# EasyEDA schematic SCH_ECU_Standalone_V2.1.json
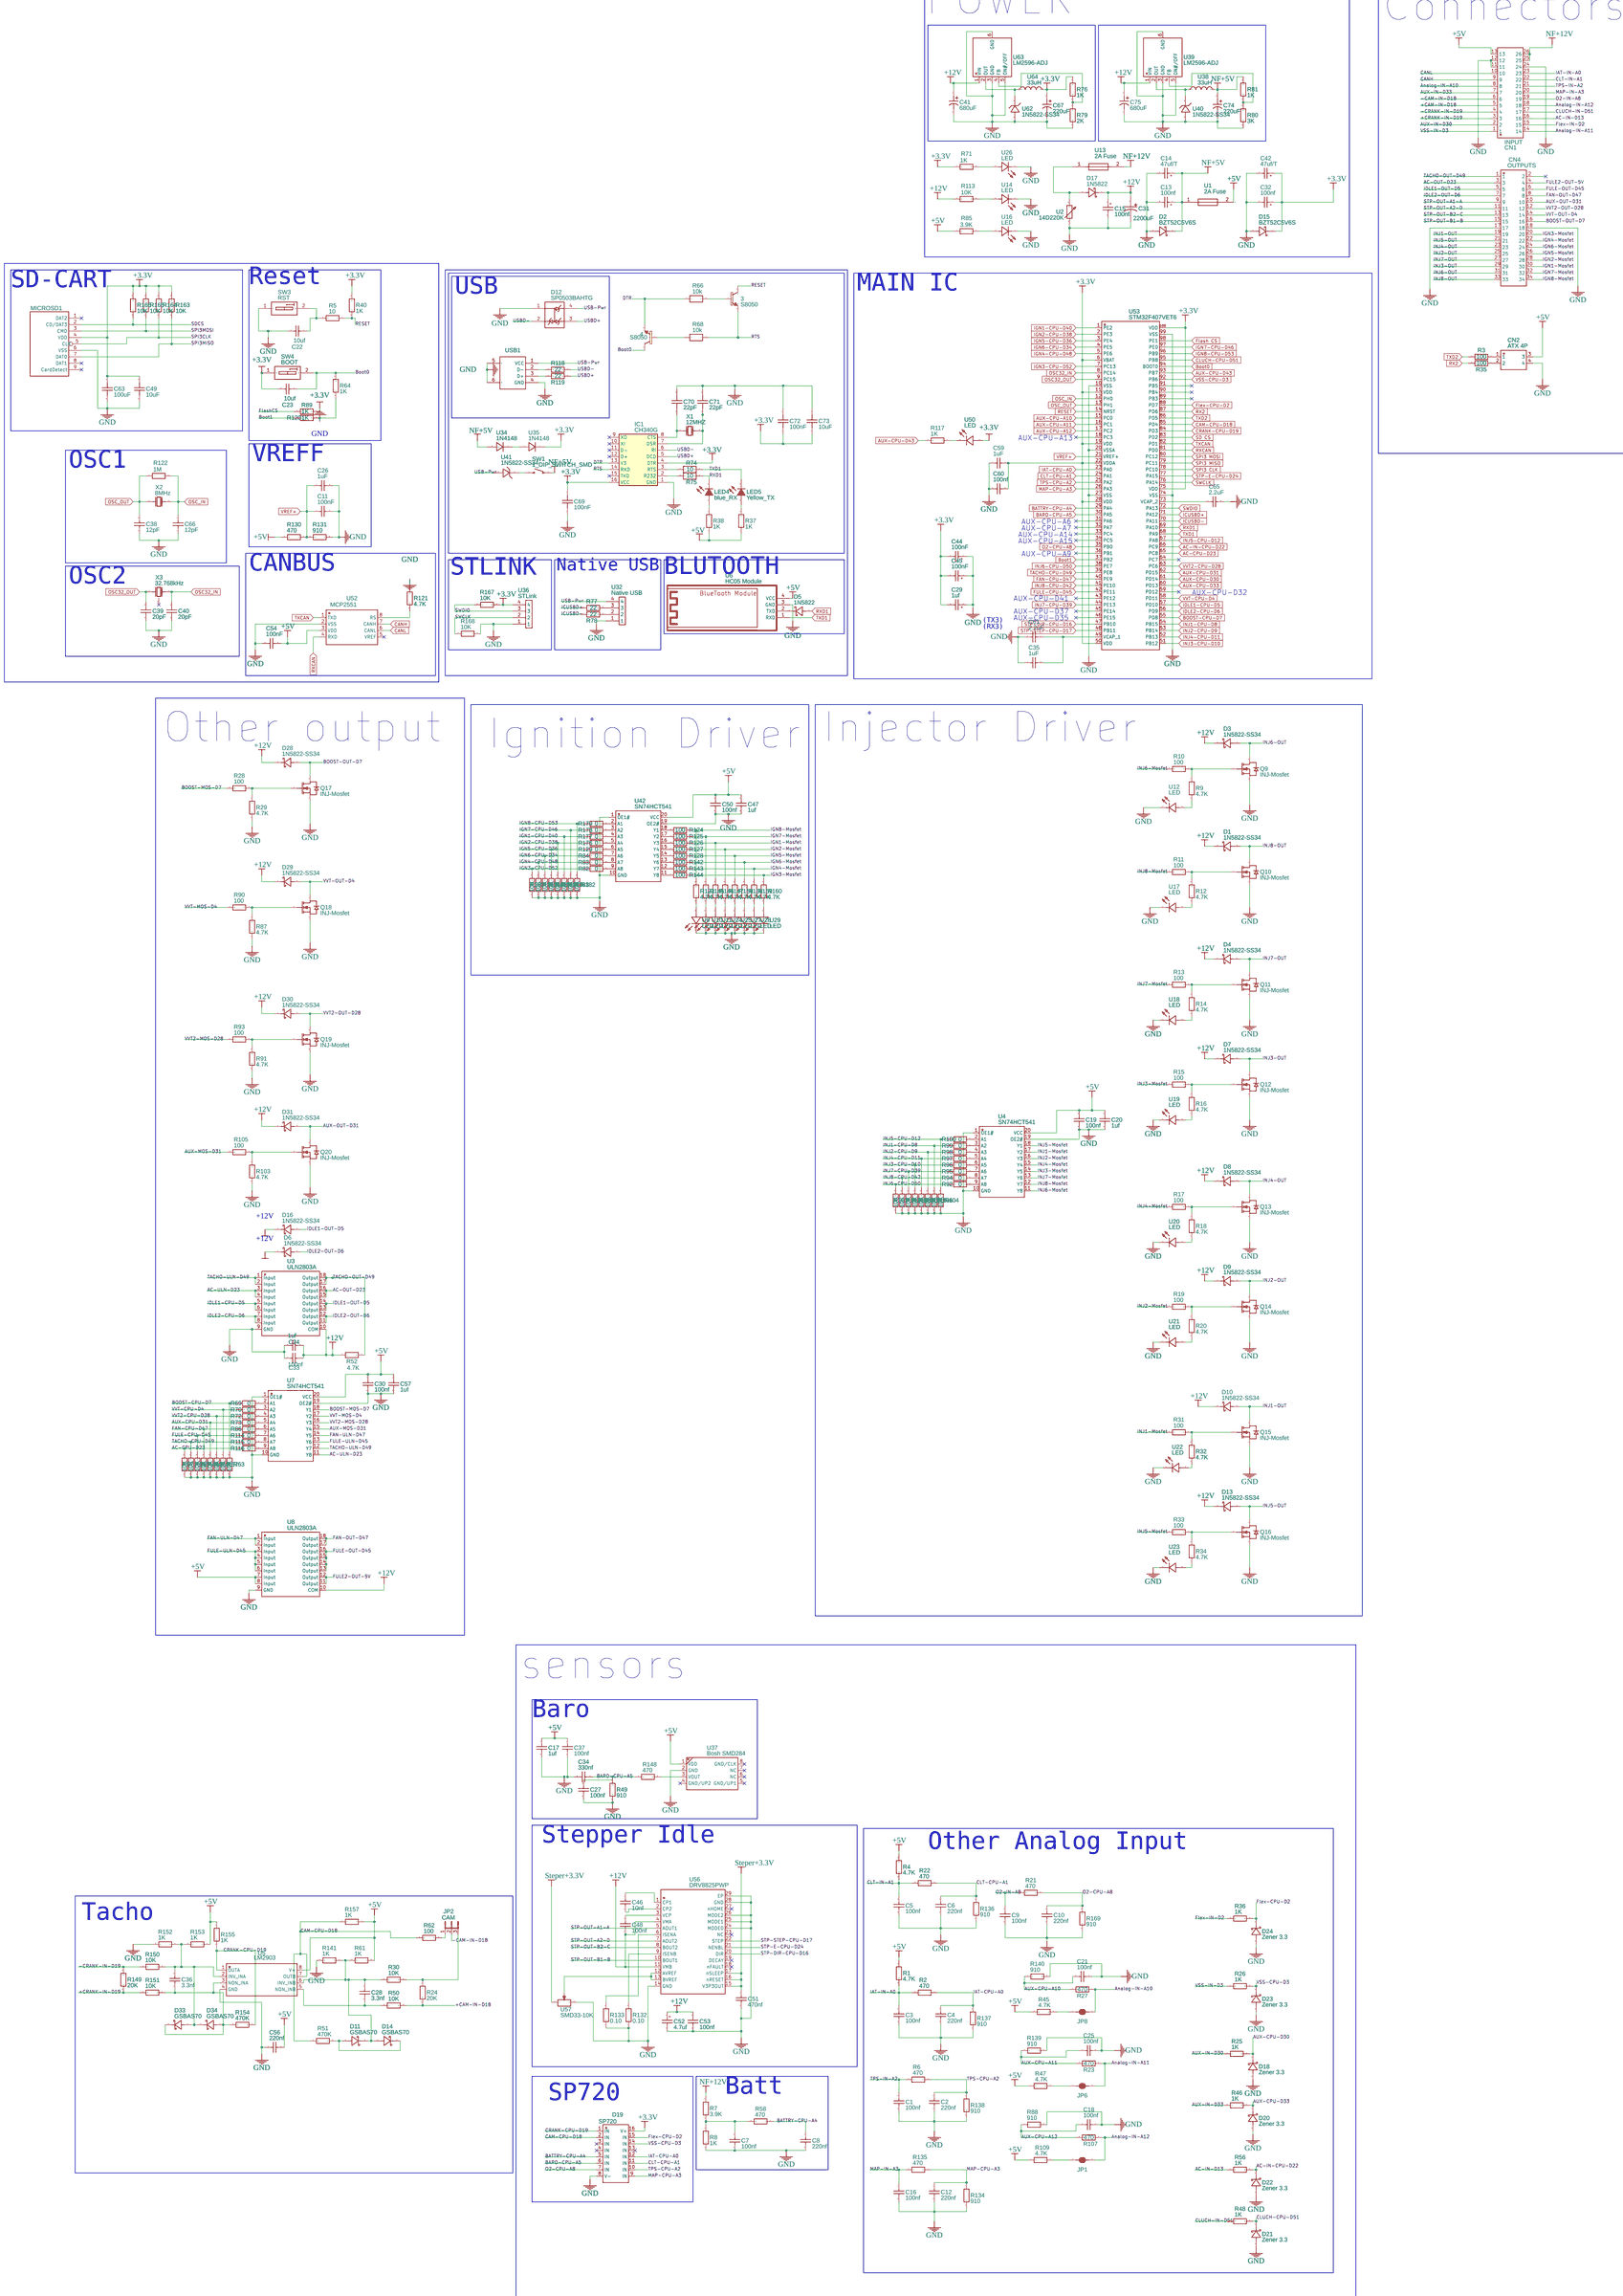
[diagram p0: schematic sheet]

## Parts
3  S8050  [SOT-23-3]
4  S8050  [SOT-23-3]
C1  100nf  [C0805]
C2  220nf  [C0805]
C3  100nf  [C0805]
C4  220nf  [C0805]
C5  100nf  [C0805]
C6  220nf  [C0805]
C7  100nf  [C0805]
C8  220nf  [C0805]
C9  100nf  [C0805]
C10  220nf  [C0805]
C11  100nF  [C0805]
C12  220nf  [C0805]
C13  100nf  [C 2512 - 0805]
C14  47uf/T  [C 2512 - 0805]
C15  100nf  [C 2512 - 0805]
C16  100nf  [C0805]
C17  1uf  [C0805]
C18  100nf  [C0805]
C19  100nf  [C0805]
C20  1uf  [C0805]
C21  100nf  [C0805]
C22  10uf  [C0805]
C23  10uf  [C0805]
C24  1uf  [C0805]
C25  100nf  [C0805]
C26  1uF  [C0805]
C27  100nf  [C0805]
C28  3.3nf  [C0805]
C29  1uf  [C 2512 - 0805]
C30  100nf  [C0805]
C31  2200uF  [CAP-TH_BD12.5-P5.00-D0.6-FD]
C32  100nf  [C 2512 - 0805]
C33  100nf  [C0805]
C34  330nf  [C0805]
C35  1uF  [C0805]
C36  3.3nf  [C0805]
C37  100nf  [C0805]
C38  12pF  [C0805]
C39  20pF  [C0805]
C40  20pF  [C0805]
C41  680uF  [CAP SMD 6.3 &#126; 8 DIP 25V]
C42  47uf/T  [C 2512 - 0805]
C44  100nF  [C 2512 - 0805]
C45  100nF  [C 2512 - 0805]
C46  10nf  [C0805]
C47  1uf  [C0805]
C48  100nf  [C0805]
C49  10uF  [C0805]
C50  100nf  [C0805]
C51  470nf  [C0805]
C52  4.7uf  [C 2512 - 0805]
C53  100nf  [C0805]
C54  100nF  [C0805]
C56  220nf  [C0805]
C57  1uf  [C0805]
C59  1uF  [C0805]
C60  100nf  [C0805]
C61  2.2uF  [C0805]
C63  100uF  [C0805]
C65  2.2uF  [C0805]
C66  12pF  [C0805]
C67  220uF  [CAP SMD 6.3 &#126; 8 DIP 25V]
C69  100nF  [C0805]
C70  22pF  [C0805]
C71  22pF  [C0805]
C72  100nF  [C0805]
C73  10uF  [C0805]
C74  220uF  [CAP SMD 6.3 &#126; 8 DIP 25V]
C75  680uF  [CAP SMD 6.3 &#126; 8 DIP 25V]
CN1  INPUT  [CONN-TH_26P-P2.50_MX23A26NF1]
CN2  ATX 4P  [CONN-TH_C4201WR-2X2P]
CN4  OUTPUTS  [CONN-TH_34P-P2.50_MX23A34NF6]
D1  1N5822-SS34  [DIOD SOD-123]
D2  BZT52C5V6S  [DIOD SOD-123]
D3  1N5822-SS34  [DIOD SOD-123]
D4  1N5822-SS34  [DIOD SOD-123]
D5  1N5822  [DIOD SOD-123]
D6  1N5822-SS34  [DIOD SOD-123]
D7  1N5822-SS34  [DIOD SOD-123]
D8  1N5822-SS34  [DIOD SOD-123]
D9  1N5822-SS34  [DIOD SOD-123]
D10  1N5822-SS34  [DIOD SOD-123]
D11  GSBAS70  [SOD-323_L1.7-W1.3-LS2.5-FD-1]
D12  SP0503BAHTG  [SOT-143_L2.9-W1.3-P1.92-LS2.3-BR]
D13  1N5822-SS34  [DIOD SOD-123]
D14  GSBAS70  [SOD-323_L1.7-W1.3-LS2.5-FD-1]
D15  BZT52C5V6S  [DIOD SOD-123]
D16  1N5822-SS34  [DIOD SOD-123]
D17  1N5822  [DIOD SOD-123]
D18  Zener 3.3  [DIOD SOD-123]
D19  SP720  [SOIC-16_L9.9-W3.9-P1.27-LS6.0-BL]
D20  Zener 3.3  [DIOD SOD-123]
D21  Zener 3.3  [DIOD SOD-123]
D22  Zener 3.3  [DIOD SOD-123]
D23  Zener 3.3  [DIOD SOD-123]
D24  Zener 3.3  [DIOD SOD-123]
D28  1N5822-SS34  [DIOD SOD-123]
D29  1N5822-SS34  [DIOD SOD-123]
D30  1N5822-SS34  [DIOD SOD-123]
D31  1N5822-SS34  [DIOD SOD-123]
D33  GSBAS70  [SOD-323_L1.7-W1.3-LS2.5-FD-1]
D34  GSBAS70  [SOD-323_L1.7-W1.3-LS2.5-FD-1]
IC1  CH340G  [SOIC-16_150MIL]
JP1  Pull-Up  [SJ_2S-NO]
JP2  CAM  [JUMPER 3X1 (PIN= 2.54) SMD]
JP6  Pull-Up  [SJ_2S-NO]
JP8  Pull-Up  [SJ_2S-NO]
LED4  blue_RX  [LED0805-R-RD]
LED5  Yellow_TX  [LED0805-R-RD]
MICROSD1  MicroSD_Slot  [MICROSD SLOT]
Q9  INJ-Mosfet  [TO-252-2_L6.6-W6.1-P4.58-LS9.9-TL]
Q10  INJ-Mosfet  [TO-252-2_L6.6-W6.1-P4.58-LS9.9-TL]
Q11  INJ-Mosfet  [TO-252-2_L6.6-W6.1-P4.58-LS9.9-TL]
Q12  INJ-Mosfet  [TO-252-2_L6.6-W6.1-P4.58-LS9.9-TL]
Q13  INJ-Mosfet  [TO-252-2_L6.6-W6.1-P4.58-LS9.9-TL]
Q14  INJ-Mosfet  [TO-252-2_L6.6-W6.1-P4.58-LS9.9-TL]
Q15  INJ-Mosfet  [TO-252-2_L6.6-W6.1-P4.58-LS9.9-TL]
Q16  INJ-Mosfet  [TO-252-2_L6.6-W6.1-P4.58-LS9.9-TL]
Q17  INJ-Mosfet  [TO-252-2_L6.6-W6.1-P4.58-LS9.9-TL]
Q18  INJ-Mosfet  [TO-252-2_L6.6-W6.1-P4.58-LS9.9-TL]
Q19  INJ-Mosfet  [TO-252-2_L6.6-W6.1-P4.58-LS9.9-TL]
Q20  INJ-Mosfet  [TO-252-2_L6.6-W6.1-P4.58-LS9.9-TL]
R1  4.7K  [R0805]
R2  470  [R0805]
R3  100  [R0805]
R4  4.7K  [R0805]
R5  10  [R0805]
R6  470  [R0805]
R7  3.9K  [R0805]
R8  1K  [R0805]
R9  4.7K  [R0805]
R10  100  [R0805]
R11  100  [R0805]
R12  4.7K  [R0805]
R13  100  [R0805]
R14  4.7K  [R0805]
R15  100  [R0805]
R16  4.7K  [R0805]
R17  100  [R0805]
R18  4.7K  [R0805]
R19  100  [R0805]
R20  4.7K  [R0805]
R21  470  [R0805]
R22  470  [R0805]
R23  470  [R0805]
R24  20K  [R0805]
R25  1K  [R0805]
R26  1K  [R0805]
R27  470  [R0805]
R28  100  [R0805]
R29  4.7K  [R0805]
R30  10K  [R0805]
R31  100  [R0805]
R32  4.7K  [R0805]
R33  100  [R0805]
R34  4.7K  [R0805]
R35  100  [R0805]
R36  1K  [R0805]
R37  1K  [R0805]
R38  1K  [R0805]
R40  1K  [R0805]
R41  10K  [R0805]
R42  10K  [R0805]
R43  10K  [R0805]
R45  4.7K  [R0805]
R46  1K  [R0805]
R47  4.7K  [R0805]
R48  1K  [R0805]
R49  910  [R0805]
R50  10K  [R0805]
R51  470K  [R0805]
R52  4.7K  [R0805]
R54  10K  [R0805]
R56  1K  [R0805]
R57  10K  [R0805]
R58  470  [R0805]
R61  1K  [R0805]
R62  100  [R0805]
R63  10K  [R0805]
R64  1K  [R0805]
R65  10K  [R0805]
R66  10k  [0805]
R67  10K  [R0805]
R68  10k  [0805]
R69  0  [R0805]
R70  0  [R0805]
R71  1K  [R0805]
R72  0  [R0805]
R73  0  [R0805]
R74  10  [0805]
R75  10  [0805]
R76  1K  [R0805]
R77  22  [R0805]
R78  22  [R0805]
R79  2K  [R0805]
R80  3K  [R0805]
R81  1K  [R0805]
R82  0  [R0805]
R83  0  [R0805]
R84  0  [R0805]
R85  3.9K  [R0805]
R86  0  [R0805]
R87  4.7K  [R0805]
R88  910  [R0805]
R89  1K  [R0805]
R90  100  [R0805]
R91  4.7K  [R0805]
R92  0  [R0805]
R93  100  [R0805]
R94  0  [R0805]
R95  0  [R0805]
R96  0  [R0805]
R97  0  [R0805]
R98  0  [R0805]
R99  0  [R0805]
R100  0  [R0805]
R101  10K  [R0805]
R102  10K  [R0805]
R103  4.7K  [R0805]
R104  10K  [R0805]
R105  100  [R0805]
R106  10K  [R0805]
R107  470  [R0805]
R108  10K  [R0805]
R109  4.7K  [R0805]
R110  10K  [R0805]
R111  10K  [R0805]
R112  10K  [R0805]
R113  10K  [R0805]
R114  0  [R0805]
R115  0  [R0805]
R116  0  [R0805]
R117  1K  [R0805]
R118  22  [R0805]
R119  22  [R0805]
R120  1K  [R0805]
R121  4.7K  [R0805]
R122  1M  [R0805]
R123  4.7K  [R0805]
R124  100  [R0805]
R125  100  [R0805]
R126  100  [R0805]
R127  100  [R0805]
R128  100  [R0805]
R129  0  [R0805]
R130  470  [R0805]
R131  910  [R0805]
R132  0.10  [R0805]
R133  0.10  [R0805]
R134  910  [R0805]
R135  470  [R0805]
R136  910  [R0805]
R137  910  [R0805]
R138  910  [R0805]
R139  910  [R0805]
R140  910  [R0805]
R141  1K  [R0805]
R142  100  [R0805]
R143  100  [R0805]
R144  100  [R0805]
R145  4.7K  [R0805]
R146  4.7K  [R0805]
R147  4.7K  [R0805]
R148  470  [R0805]
R149  20K  [R0805]
R150  10K  [R0805]
R151  10K  [R0805]
R152  1K  [R0805]
R153  1K  [R0805]
R154  470K  [R0805]
R155  1K  [R0805]
R156  4.7K  [R0805]
R157  1K  [R0805]
R158  4.7K  [R0805]
R159  4.7K  [R0805]
R160  4.7K  [R0805]
R163  10K  [R0805]
R164  10K  [R0805]
R165  10K  [R0805]
R166  10K  [R0805]
R167  10K  [R0805]
R168  10K  [R0805]
R169  910  [R0805]
R176  0  [R0805]
R177  0  [R0805]
R178  0  [R0805]
R179  0  [R0805]
R180  10K  [R0805]
R181  10K  [R0805]
R182  10K  [R0805]
R183  10K  [R0805]
R184  10K  [R0805]
R185  10K  [R0805]
R186  10K  [R0805]
R187  10K  [R0805]
SW1  1_DIP_SWITCH_SMD  [1_DIP_SWITCH_SMD]
SW3  RST  [SW-SMD_L5.4-W2.8-LS8.2]
SW4  BOOT  [SW-SMD_L5.4-W2.8-LS8.2]
U1  2A Fuse  [CAR FUSE]
U2  14D220K  [PS-RES-16.5*7.51_SMALLER]
U3  ULN2803A  [SOP-18_L11.4-W7.6-P1.27-LS10.6-BL]
U4  SN74HCT541  [SOIC-20_L12.8-W7.5-P1.27-LS10.3-BL]
U5  LM2903  [SOIC-8_L4.9-W3.9-P1.27-LS6.0-BL]
U6  HC05 Module  [HC05_MODULE]
U7  SN74HCT541  [SOIC-20_L12.8-W7.5-P1.27-LS10.3-BL]
U8  ULN2803A  [SOP-18_L11.4-W7.6-P1.27-LS10.6-BL]
U9  LED  [LED0805-RD_RED]
U10  LED  [LED0805-RD_RED]
U11  LED  [LED0805-RD_RED]
U12  LED  [LED0805-RD_RED]
U13  2A Fuse  [CAR FUSE]
U14  LED  [LED0805-RD_RED]
U16  LED  [LED0805-RD_RED]
U17  LED  [LED0805-RD_RED]
U18  LED  [LED0805-RD_RED]
U19  LED  [LED0805-RD_RED]
U20  LED  [LED0805-RD_RED]
U21  LED  [LED0805-RD_RED]
U22  LED  [LED0805-RD_RED]
U23  LED  [LED0805-RD_RED]
U24  LED  [LED0805-RD_RED]
U25  LED  [LED0805-RD_RED]
U26  LED  [LED0805-RD_RED]
U27  LED  [LED0805-RD_RED]
U28  LED  [LED0805-RD_RED]
U29  LED  [LED0805-RD_RED]
U32  Native USB  [1X4 HEADER (PIN = 2.54)]
U34  1N4148  [LL-34_L3.5-W1.5-RD]
U35  1N4148  [LL-34_L3.5-W1.5-RD]
U36  STLink  [1X4 HEADER (PIN = 2.54)]
U37  Bosh SMD284  [BOSH SMD284]
U38  33uH  [IND-SMD_L12.3-W12.3]
U39  LM2596-ADJ  [TO-263-5_L10.2-W8.6-P1.70-LS14.4-TL]
U40  1N5822-SS34  [SMB_L4.3-W3.6-LS5.4-RD]
U41  1N5822-SS34  [SMB_L4.3-W3.6-LS5.4-RD]
U42  SN74HCT541  [SOIC-20_L12.8-W7.5-P1.27-LS10.3-BL]
U50  LED  [LED0805-RD_RED]
U52  MCP2551  [SOIC-8_L5.0-W4.0-P1.27-LS6.0-BL]
U53  STM32F407VET6  [LQFP-100_L14.0-W14.0-P0.50-LS16.0-BL]
U56  DRV8825PWP  [HTSSOP-28_L9.7-W4.4-P0.65-LS6.4-BL-EP]
U57  SMD33-10K  [RES-ADJ-SMD_SMD33-10K]
U62  1N5822-SS34  [SMB_L4.3-W3.6-LS5.4-RD]
U63  LM2596-ADJ  [TO-263-5_L10.2-W8.6-P1.70-LS14.4-TL]
U64  33uH  [IND-SMD_L12.3-W12.3]
USB1  U241-041N-1BR85-1  [USB-B-TH_U241-041N-1BR85-1]
X1  12MHZ  [HC-49S_L11.4-W4.8-LS12.7]
X2  8MHz  [HC-49S_L11.4-W4.8-LS12.7]
X3  32.768kHz  [OSC-SMD_BD2.0-P2.54_TMXLI-206F32.768KHZ12.5PF20PPM]

## Library data of the parts
3 4 = J3Y_S8050_SMD_NPN_TRANSISTOR: Contributor: Tomaž Pačnik
C1-C12 C16-C28 C30 C33-C40 C46-C48 C50 C51 C53 C54 C56 C57 C59-C61 C65 C66 = C0805X103K251T: Supplier: LCSC; Manufacturer: IHHEC(禾伸堂); Supplier Part: C105949; JLCPCB Part Class: Extended Part
C13-C15 C32 C42 C44 C45 C52 = C SMD (2512 - 0805): Supplier: LCSC; Supplier Part: C269368; Manufacturer: Tyohm; Manufacturer Part: RMC25124.7K1%N; Resistance (Ohms): 1uf; Contributor: amir slz; JLCPCB Part Class: Extended Part
C29 = C SMD (2512 - 0805): Supplier: LCSC; Supplier Part: C269368; Manufacturer: Tyohm; Manufacturer Part: RMC25124.7K1%N; Contributor: amir slz; JLCPCB Part Class: Extended Part
C31 = 25YXG2200MEFCG412.5X35: Contributor: lcsc; Supplier: LCSC; Supplier Part: C5114672; Manufacturer: rubycon(红宝石)
C41 C67 C74 C75 = CAP 6.3 &#126; 0.8 DIP 25v: Supplier Part: C2693600; Manufacturer: SAMYOUNG(韩国三莹); Manufacturer Part: MVK16V100UF6.3*6; JLCPCB Part Class: Extended Part; Contributor: amir slz
C49 C63 C69-C73 = C0805C682KMRECAUTO7210: Supplier: LCSC; Supplier Part: C1625609; Manufacturer: KEMET(基美); Contributor: LCSC; JLCPCB Part Class: Extended Part
CN1 = MX23A26NF1: Supplier: LCSC; Supplier Part: C2977281; Manufacturer: JAE(日本航空电子); Contributor: lcsc; JLCPCB Part Class: Extended Part
CN2 = C4201WR-2X2P: Contributor: LCSC; Supplier: LCSC; Supplier Part: C239496; Manufacturer: CJT(长江连接器); Manufacturer Part: C4201WR-2x2P; JLCPCB Part Class: Extended Part
CN4 = MX23A34NF1: Supplier: LCSC; Supplier Part: C2977283; Manufacturer: JAE(日本航空电子); JLCPCB Part Class: Extended Part; Contributor: lcsc
D1-D10 D13 D15-D18 D20-D24 D28-D31 = DIOD SOD-123: Contributor: amir slz; Supplier: LCSC; Supplier Part: C2905649; Manufacturer: TECH PUBLIC(台舟); Manufacturer Part: 1N5819HW; JLCPCB Part Class: Extended Part
D11 D14 D33 D34 = GSBAS70WS: Supplier: LCSC; Supplier Part: C19840816; Manufacturer: GOOD-ARK(固锝); JLCPCB Part Class: Extended Part; Contributor: lcsc
D12 = SP0503BAHTG: Supplier: LCSC; Manufacturer: Littelfuse; image: //image.lceda.cn/szlcsc/C7074.jpg; Supplier Part: C7074; LCSC Assembly: Yes; SMT Type: Extend
D19 = SP720ABTG: Supplier: LCSC; Supplier Part: C434726; Manufacturer: Littelfuse; Contributor: LCSC; JLCPCB Part Class: Extended Part
IC1 = -: Supplier: LCSC; Manufacturer: WCH; LCSC Assembly: Yes; Supplier Part: C14267
JP1 JP6 JP8 = SOLDERJUMPER-OLDNO: Solder Jumper; Contributor: SparkFun
JP2 = JUMPER 3X1 (PIN= 2.54) SMD: Jumper 2 Pin; Contributor: amir slz; sourceId: neOM8uspn
LED4 LED5 = 0805-1-YGC/FID: Contributor: lcsc; Supplier: LCSC; Supplier Part: C9900013796; Manufacturer: null; JLCPCB Part Class: Extended Part; link: https://lcsc.com/eda_search?q=C9900013796&%26type=1&ref=editor
MICROSD1 = -: Manufacturer Part: MicroSD Slot; Contributor: FromRussia
Q9-Q20 = PHD45N03LTA: Contributor: LCSC; Supplier: LCSC; Supplier Part: C693162; Manufacturer: VBsemi(微碧半导体); Manufacturer Part: PHD45N03LTA-VB; JLCPCB Part Class: Extended Part
R1-R36 R40-R43 R45-R52 R54 R56-R58 R61-R65 R67 R69-R73 R76-R160 R167-R169 R176-R187 = AECR0805F: Supplier: LCSC; Supplier Part: C352165; Manufacturer: ResistorToday; Manufacturer Part: AECR0805F9K10K9; Resistance (Ohms): 9.1K; Contributor: myungsoo4545; JLCPCB Part Class: Extended Part
R37 R38 = RC0805FR-072K74L: Supplier: LCSC; Manufacturer: YAGEO; Supplier Part: C137554; JLCPCB Part Class: Extended Part
R66 R68 R74 R75 = Res_0805(1/8W)_EU
R163-R166 = 500M: Contributor: LCSC; Supplier: LCSC; Supplier Part: C9900011239; Manufacturer: null; JLCPCB Part Class: Extended Part
SW1 = 1_DIP_SWITCH_SMD: Contributor: amir slz
SW3 SW4 = BDSWITCH-2PIN-1CH-1R27-SMD-V: Supplier: LCSC; Supplier Part: C9900022896; Manufacturer: null; Manufacturer Part: BDSwitch-2pin-1CH-1r27-SMD-V; JLCPCB Part Class: Extended Part; Contributor: lcsc
U1 U13 = Car fuse mini: Supplier Part: Fuse; Contributor: wygralakmarek
U2 = 14D220K: Supplier: LCSC; Manufacturer: HEL; Supplier Part: C136782
U3 U8 = ULN2803A_C845537: Supplier: LCSC; Supplier Part: C845537; Manufacturer: UMW(Youtai Semiconductor Co., Ltd.); Contributor: LCSC; JLCPCB Part Class: Extended Part
U4 U7 U42 = SN74HCT541DWE4: Contributor: LCSC; Supplier: LCSC; Supplier Part: C1548616; Manufacturer: TI(德州仪器); JLCPCB Part Class: Extended Part
U5 = LM2903M/NOPB: Contributor: LCSC; Supplier: LCSC; Supplier Part: C2864309; Manufacturer: TI(德州仪器); JLCPCB Part Class: Extended Part
U6 = HC05 Module: Contributor: amirslz74
U9-U12 U14 U16-U29 U50 = 0805 SF-RED: Contributor: lcsc; Supplier: LCSC; Supplier Part: C9900020303; Manufacturer: null; Manufacturer Part: 0805 SF-Red; JLCPCB Part Class: Extended Part
U32 U36 = 1X4 Header (Pin = 2.54): Manufacturer Part: Male Header 2 pin; Contributor: amir slz
U34 U35 = 1N4148_C9900015438: Contributor: lcsc; Supplier: LCSC; Supplier Part: C9900015438; Manufacturer: null; JLCPCB Part Class: Extended Part; link: https://lcsc.com/eda_search?q=C9900015438&%26type=1&ref=editor
U37 = Bosh SMD284: Contributor: amir slz; Supplier: LCSC; Supplier Part: C184770; Manufacturer: MICROCHIP(美国微芯); Manufacturer Part: TC4424AVPA; JLCPCB Part Class: Extended Part
U38 U64 = SMDRI125-330MT: Contributor: lcsc; Supplier: LCSC; Supplier Part: C3000382; Manufacturer: SXN(顺翔诺); JLCPCB Part Class: Extended Part
U39 U63 = LM2596GR-5.0: Contributor: lcsc; Supplier: LCSC; Supplier Part: C2915258; Manufacturer: HTC; JLCPCB Part Class: Extended Part
U40 U41 U62 = 1N5822-SS34: Contributor: LCSC; Supplier: LCSC; Supplier Part: C9900010596; Manufacturer: null; JLCPCB Part Class: Extended Part
U52 = MCP2551T-I/SN: Supplier: LCSC; Manufacturer: MICROCHIP; image: //image.lceda.cn/szlcsc/C49558.jpg; Supplier Part: C49558; LCSC Assembly: Yes; SMT Type: Extend
U53 = STM32F407VGT6: tags: STM32; Supplier Part: C28730; Supplier: LCSC; Manufacturer: ST; subpart_no: 1; image: http://image.lceda.cn/szlcsc/C12345.jpg; LCSC Assembly: Yes; SMT Type: Basic
U56 = DRV8825PWP: Contributor: LCSC; Supplier: LCSC; Supplier Part: C1523893; Manufacturer: TI(德州仪器); JLCPCB Part Class: Extended Part
U57 = SMD33-10K: Contributor: LCSC; Supplier: LCSC; Supplier Part: C9900001299; Manufacturer: null; JLCPCB Part Class: Extended Part
USB1 = U241-041N-1BR85-1: Supplier: LCSC; Supplier Part: C397338; Manufacturer: XKB Enterprise; Contributor: LCSC
X1 = XTAL-HC-49SMD: Supplier: LCSC; Supplier Part: C9900009019; Manufacturer: null; Contributor: LCSC; JLCPCB Part Class: Extended Part
X2 = H6OEL89CSC-SUGYLC-8M: Supplier: LCSC; Supplier Part: C7471629; Manufacturer: YXC(扬兴晶振); Contributor: lcsc; JLCPCB Part Class: Extended Part
X3 = TMXLi-206F 32.768KHZ 12.5PF 20PPM: Contributor: LCSC; Supplier: LCSC; Supplier Part: C145165; Manufacturer: YJX(雅晶鑫); Manufacturer Part: TAXM32768K2BGDAZN2T; JLCPCB Part Class: Extended Part

## Nets
+3.3V: C23.2 C29.2 C32.1 C42.1 C44.2 C45.2 C49.1 C59.2 C60.2 C63.1 C67.1 C69.2 C72.1 C73.1 D15.1(K) D19.16(V+) IC1.4(DTR) IC1.16(VCC) MICROSD1.4(VDD) R40.2 R71.1 R76.2 R89.1 R163.2 R164.2 R165.2 R166.2 R167.2 SW4.1(A1) U35.1 U36.4 U50.2(A) U53.6(VBAT) U53.11(VDD) U53.19(VDD) U53.22(VDDA) U53.28(VDD) U53.50(VDD) U53.75(VDD) U53.100(VDD) U64.2
+5V: C17.1 C19.1 C20.1 C30.1 C37.1 C47.1 C50.1 C54.1 C56.2 C57.1 CN1.13 CN2.3 R1.1 R4.1 R37.1 R38.1 R45.1 R47.1 R61.1 R85.1 R109.1 R130.2 R153.1 R155.1 R157.1 U1.2 U4.20(VCC) U5.8(V+) U6.4(VCC) U7.20(VCC) U8.7(Input) U8.8(Input) U37.1(VDD) U42.20(VCC) U52.3(VDD)
+12V: C15.1 C24.1 C31.1 C33.1 C41.1 C48.2 C52.1 C53.1 C75.1 D1.1(K) D3.1(K) D4.1(K) D6.1(K) D7.1(K) D8.1(K) D9.1(K) D10.1(K) D13.1(K) D16.1(K) D17.1(K) D28.1(K) D29.1(K) D30.1(K) D31.1(K) R52.1 R113.1 U3.10(COM) U8.10(COM) U39.1(VIN) U56.4(VMA) U56.11(VMB) U63.1(VIN)
GND: C1.2 C2.2 C3.2 C4.2 C5.2 C6.2 C7.2 C8.2 C9.2 C10.2 C11.2 C12.2 C13.2 C14.2 C15.2 C16.2 C17.2 C18.2 C19.2 C20.2 C21.2 C22.2 C24.2 C25.2 C26.2 C27.2 C29.1 C30.2 C31.2 C32.2 C33.2 C34.2 C35.1 C37.2 C38.1 C39.1 C40.1 C41.2 C42.2 C44.1 C45.1 C47.2 C49.2 C50.2 C51.2 C52.2 C53.2 C54.2 C56.1 C57.2 C59.1 C60.1 C61.1 C63.2 C65.2 C66.1 C67.2 C69.1 C70.2 C71.2 C72.2 C73.2 C74.2 C75.2 CN1.11 CN1.12 CN1.24 CN2.4 CN4.17 CN4.18 D2.2(A) D12.1 D15.2(A) D18.2(A) D19.8(V-) D20.2(A) D21.2(A) D22.2(A) D23.2(A) D24.2(A) IC1.1(GND) MICROSD1.6(VSS) Q9.3(S) Q10.3(S) Q11.3(S) Q12.3(S) Q13.3(S) Q14.3(S) Q15.3(S) Q16.3(S) Q17.3(S) Q18.3(S) Q19.3(S) Q20.3(S) R8.1 R29.2 R41.1 R42.1 R43.1 R49.2 R54.1 R57.1 R63.1 R64.1 R65.1 R67.1 R79.1 R80.1 R87.2 R88.2 R91.2 R101.1 R102.1 R103.2 R104.1 R106.1 R108.1 R110.1 R111.1 R112.1 R120.1 R121.2 R131.1 R132.1 R133.1 R134.2 R136.2 R137.2 R138.2 R139.2 R140.2 R141.2 R152.2 R168.1 R169.2 R180.1 R181.1 R182.1 R183.1 R184.1 R185.1 R186.1 R187.1 SW3.1(A1) U2.1 U3.9(GND) U4.1(OE1#) U4.10(GND) U4.19(OE2#) U5.4(GND) U6.3(GND) U7.1(OE1#) U7.10(GND) U7.19(OE2#) U8.9(GND) U9.1(K) U10.1(K) U11.1(K) U12.1(K) U14.1(K) U16.1(K) U17.1(K) U18.1(K) U19.1(K) U20.1(K) U21.1(K) U22.1(K) U23.1(K) U24.1(K) U25.1(K) U26.1(K) U27.1(K) U28.1(K) U29.1(K) U32.1 U36.1 U37.2(GND) U39.3(GND) U39.5(ON#/OFF) U39.6(GND) U40.2(A) U42.1(OE1#) U42.10(GND) U42.19(OE2#) U52.2(VSS) U53.10(VSS) U53.20(VSSA) U53.27(VSS) U53.74(VSS) U53.99(VSS) U56.14(GND) U56.24(MODE0) U56.25(MODE1) U56.26(MODE2) U56.28(GND) U56.29(EP) U57.3 U62.2(A) U63.3(GND) U63.5(ON#/OFF) U63.6(GND) USB1.4(GND) USB1.5(SH1) USB1.6(SH2)
VSS-CPU-D3: D19.14(IN) D23.1(K) R26.2 U53.92(PB6)
VSS-IN-D3: CN1.1 R26.1
+CAM-IN-D18: CN1.5 R24.2 R50.2
+CRANK-IN-D19: CN1.3 R149.1 R151.2
-CAM-IN-D18: CN1.6 JP2.2
-CRANK-IN-D19: CN1.4 R149.2 R150.2
AC-CPU-D23: R67.2 R116.1 U53.65(PC8)
AC-IN-CPU-D22: D22.1(K) R56.2 U53.66(PC9)
AC-IN-D13: CN1.16 R56.1
AC-OUT-D23: CN4.3 U3.15(Output) U3.16(Output)
AC-ULN-D23: U3.3(Input) U3.4(Input) U7.11(Y8)
Analog-IN-A10: CN1.8 JP8.2 R27.1
Analog-IN-A11: CN1.14 JP6.2 R23.1
Analog-IN-A12: CN1.18 JP1.2 R107.1
AUX-CPU-A10: C21.1 R27.2 R140.1 U53.15(PC0)
AUX-CPU-A11: C25.1 R23.2 R139.1 U53.16(PC1)
AUX-CPU-A12: C18.1 R88.1 R107.2 U53.17(PC2)
AUX-CPU-D30: D18.1(K) R25.2 U53.61(PD14)
AUX-CPU-D31: R42.2 R73.1 U53.62(PD15)
AUX-CPU-D33: D20.1(K) R46.2 U53.60(PD13)
AUX-CPU-D43: R117.2 U53.93(PB7)
AUX-IN-D30: CN1.2 R25.1
AUX-IN-D33: CN1.7 R46.1
AUX-MOS-D31: R105.2 U7.15(Y4)
AUX-OUT-D31: CN4.10 D31.2(A) Q20.2(D)
BARO-CPU-A5: C27.1 C34.1 D19.6(IN) R49.1 R148.1 U53.30(PA5)
BATTRY-CPU-A4: C8.1 D19.5(IN) R58.1 U53.29(PA4)
BOOST-CPU-D7: R63.2 R69.1 U53.55(PD8)
BOOST-MOS-D7: R28.2 U7.18(Y1)
BOOST-OUT-D7: CN4.16 D28.2(A) Q17.2(D)
Boot0: 4.2(C) C23.1 R64.2 SW4.2(B1) U53.94(BOOT0)
Boot1: R120.2 U53.37(PB2)
CAM-CPU-D18: D19.2(IN) R51.1 R62.1 R157.2 U5.7(OUTB) U53.85(PD4)
CANH: CN1.9 U52.7(CANH)
CANL: CN1.10 U52.6(CANL)
CLT-CPU-A1: C6.1 D19.11(IN) R22.1 R136.1 U53.24(PA1)
CLT-IN-A1: C5.1 CN1.22 R4.2 R22.2
CLUCH-CPU-D51: D21.1(K) R48.2 U53.95(PB8)
CLUCH-IN-D51: CN1.17 R48.1
CRANK-CPU-D19: D19.1(IN) R154.1 R155.2 U5.1(OUTA) U53.84(PD3)
DTR: 4.3(E) IC1.13(V3) R66.1
FAN-CPU-D47: R43.2 R86.1 U53.40(PE9)
FAN-OUT-D47: CN4.8 U8.17(Output) U8.18(Output)
FAN-ULN-D47: U7.14(Y5) U8.1(Input) U8.2(Input)
Flash CS: U53.98(PE1)
FlashCS: R89.2
Flex-CPU-D2: D19.15(IN) D24.1(K) R36.2 U53.88(PD7)
Flex-IN-D2: CN1.15 R36.1
FULE2-OUT-5V: CN4.4 U8.11(Output) U8.12(Output)
FULE-CPU-D45: R54.2 R114.1 U53.42(PE11)
FULE-OUT-D45: CN4.6 U8.13(Output) U8.14(Output) U8.15(Output) U8.16(Output)
FULE-ULN-D45: U7.13(Y6) U8.3(Input) U8.4(Input) U8.5(Input) U8.6(Input)
IAT-CPU-A0: C4.1 D19.12(IN) R2.1 R137.1 U53.23(PA0)
IAT-IN-A0: C3.1 CN1.23 R1.2 R2.2
ICUSBD+: R77.1 U53.71(PA12)
ICUSBD-: R78.1 U53.70(PA11)
IDLE1-CPU-D5: U3.5(Input) U3.6(Input) U53.57(PD10)
IDLE1-OUT-D5: CN4.5 D16.2(A) U3.13(Output) U3.14(Output)
IDLE2-CPU-D6: U3.7(Input) U3.8(Input) U53.56(PD9)
IDLE2-OUT-D6: CN4.7 D6.2(A) U3.11(Output) U3.12(Output)
IGN1-CPU-D40: R177.1 R187.2 U53.1(PE2)
IGN1-Mosfet: CN4.30 R126.1 R146.2
IGN2-CPU-D38: R176.1 R186.2 U53.2(PE3)
IGN2-Mosfet: CN4.28 R127.1 R147.2
IGN3-CPU-D52: R82.1 R180.2 U53.7(PC13)
IGN3-Mosfet: CN4.20 R144.1 R160.2
IGN4-CPU-D48: R83.1 R181.2 U53.5(PE6)
IGN4-Mosfet: CN4.22 R143.1 R159.2
IGN5-CPU-D36: R129.1 R185.2 U53.3(PE4)
IGN5-Mosfet: CN4.26 R128.1 R156.2
IGN6-CPU-D34: R84.1 R184.2 U53.4(PE5)
IGN6-Mosfet: CN4.24 R142.1 R158.2
IGN7-CPU-D46: R178.1 R183.2 U53.97(PE0)
IGN7-Mosfet: CN4.32 R125.1 R145.2
IGN8-CPU-D53: R179.1 R182.2 U53.96(PB9)
IGN8-Mosfet: CN4.34 R123.2 R124.1
INJ1-CPU-D8: R99.1 R106.2 U53.54(PB15)
INJ1-Mosfet: R31.2 U4.17(Y2)
INJ1-OUT: CN4.19 D10.2(A) Q15.2(D)
INJ2-CPU-D9: R98.1 R112.2 U53.53(PB14)
INJ2-Mosfet: R19.2 U4.16(Y3)
INJ2-OUT: CN4.25 D9.2(A) Q14.2(D)
INJ3-CPU-D10: R96.1 R110.2 U53.51(PB12)
INJ3-Mosfet: R15.2 U4.14(Y5)
INJ3-OUT: CN4.29 D7.2(A) Q12.2(D)
INJ4-CPU-D11: R97.1 R111.2 U53.52(PB13)
INJ4-Mosfet: R17.2 U4.15(Y4)
INJ4-OUT: CN4.23 D8.2(A) Q13.2(D)
INJ5-CPU-D12: R100.1 R104.2 U53.67(PA8)
INJ5-Mosfet: R33.2 U4.18(Y1)
INJ5-OUT: CN4.21 D13.2(A) Q16.2(D)
INJ6-CPU-D50: R92.1 R101.2 U53.38(PE7)
INJ6-Mosfet: R10.2 U4.11(Y8)
INJ6-OUT: CN4.31 D3.2(A) Q9.2(D)
INJ7-CPU-D39: R95.1 R108.2 U53.44(PE13)
INJ7-Mosfet: R13.2 U4.13(Y6)
INJ7-OUT: CN4.27 D4.2(A) Q11.2(D)
INJ8-CPU-D42: R94.1 R102.2 U53.41(PE10)
INJ8-Mosfet: R11.2 U4.12(Y7)
INJ8-OUT: CN4.33 D1.2(A) Q10.2(D)
MAP-CPU-A3: C12.1 D19.9(IN) R134.1 R135.1 U53.26(PA3)
MAP-IN-A3: C16.1 CN1.20 R135.2
NF+5V: C13.1 C14.1 C74.1 D2.1(K) R81.2 SW1.2 U1.1 U34.2 U38.2
NF+12V: CN1.25 CN1.26 R7.2 U13.2
O2-CPU-A8: C10.1 D19.7(IN) R21.1 R169.1 U53.35(PB0)
O2-IN-A8: C9.1 CN1.19 R21.2
OSC32_IN: C40.2 U53.8(PC14) X3.2(OSC2)
OSC32_OUT: C39.2 U53.9(PC15) X3.1(OSC1)
OSC_IN: C66.2 R122.2 U53.12(PH0) X2.2(OSC2)
OSC_OUT: C38.2 R122.1 U53.13(PH1) X2.1(OSC1)
RESET: 3.2(C) R5.1 R40.1 U53.14(NRST)
RTS: 3.3(E) IC1.14(RXD) R68.2
RX2: R35.2 U53.87(PD6)
RXCAN: U52.4(RXD) U53.81(PD0)
RXD1: D5.2(A) LED4.2(C) R75.2 U53.69(PA10)
SD CS: U53.83(PD2)
SDCS: MICROSD1.2(CD/DAT3) R166.1
SPI3 CLK: U53.78(PC10)
SPI3 MISO: U53.79(PC11)
SPI3 MOSI: U53.80(PC12)
SPI3CLK: MICROSD1.5(CLK) R164.1
SPI3MISO: MICROSD1.7(DAT0) R163.1
SPI3MOSI: MICROSD1.3(CMD) R165.1
Steper+3.3V: C51.1 U56.15(V3P3OUT) U56.16(nRESET) U56.17(nSLEEP) U57.1
STP-DIR-CPU-D16: U53.47(PB10) U56.20(DIR)
STP-E-CPU-D24: U53.77(PA15) U56.21(NENBL)
STP-OUT-A1-A: CN4.9 U56.5(AOUT1)
STP-OUT-A2-D: CN4.11 U56.7(AOUT2)
STP-OUT-B1-B: CN4.15 U56.10(BOUT1)
STP-OUT-B2-C: CN4.13 U56.8(BOUT2)
STP-STEP-CPU-D17: U53.48(PB11) U56.22(STEP)
SWCLK: R168.2 U36.2 U53.76(PA14)
SWDIO: R167.1 U36.3 U53.72(PA13)
TACHO-CPU-D49: R65.2 R115.1 U53.39(PE8)
TACHO-OUT-D49: CN4.1 R52.2 U3.17(Output) U3.18(Output)
TACHO-ULN-D49: U3.1(Input) U3.2(Input) U7.12(Y7)
TPS-CPU-A2: C2.1 D19.10(IN) R6.1 R138.1 U53.25(PA2)
TPS-IN-A2: C1.1 CN1.21 R6.2
TXCAN: U52.1(TXD) U53.82(PD1)
TXD1: LED5.2(C) R74.2 U6.1(RXD) U53.68(PA9)
TXD2: R3.2 U53.86(PD5)
USB-Pwr: D12.4 U32.4 U41.2(A) USB1.1(VCC)
USBD+: D12.3 IC1.5(DCD) R119.2
USBD-: D12.2 IC1.6(RI) R118.2
VREF+: C11.1 C26.1 R130.1 R131.2 U53.21(VREF+)
VVT2-CPU-D28: R41.2 R72.1 U53.63(PC6)
VVT2-MOS-D28: R93.2 U7.16(Y3)
VVT2-OUT-D28: CN4.12 D30.2(A) Q19.2(D)
VVT-CPU-D4: R57.2 R70.1 U53.58(PD11)
VVT-MOS-D4: R90.2 U7.17(Y2)
VVT-OUT-D4: CN4.14 D29.2(A) Q18.2(D)
Net-(3-1): 3.1(B) R66.2
Net-(4-1): 4.1(B) R68.1
Net-(C7-1): C7.1 R7.1 R8.2 R58.2
Net-(C22-1): C22.1 R5.2 SW3.2(B1)
Net-(C28-1): C28.1 D11.2(K) D14.1(A) R30.1 R61.2 R141.1 U5.6(INV_INB)
Net-(C28-2): C28.2 R50.1 U5.5(NON_INB)
Net-(C35-2): C35.2 C61.2 U53.49(VCAP_1)
Net-(C36-1): C36.1 D33.1(A) D34.2(K) R150.1 R152.1 R153.2 U5.2(INV_INA)
Net-(C36-2): C36.2 D33.2(K) D34.1(A) R151.1 R154.2 U5.3(NON_INA)
Net-(C46-1): C46.1 U56.1(CP1)
Net-(C46-2): C46.2 U56.2(CP2)
Net-(C48-1): C48.1 U56.3(VCP)
Net-(C65-1): C65.1 U53.73(VCAP_2)
Net-(C70-1): C70.1 IC1.8(CTS) X1.1(OSC1)
Net-(C71-1): C71.1 IC1.7(DSR) X1.2(OSC2)
Net-(CN2-1): CN2.1 R3.1
Net-(CN2-2): CN2.2 R35.1
Net-(D5-1): D5.1(K) U6.2(TXD)
Net-(D11-1): D11.1(A) D14.2(K) R51.2
Net-(D17-2): D17.2(A) U2.2 U13.1
Net-(IC1-2): IC1.2(R232) R75.1
Net-(IC1-3): IC1.3(RTS) R74.1
Net-(JP1-1): JP1.1 R109.2
Net-(JP2-1): JP2.1 R62.2
Net-(JP2-3): JP2.3 R24.1 R30.2
Net-(JP6-1): JP6.1 R47.2
Net-(JP8-1): JP8.1 R45.2
Net-(LED4-1): LED4.1(A) R38.2
Net-(LED5-1): LED5.1(A) R37.2
Net-(Q9-1): Q9.1(G) R9.2 R10.1
Net-(Q10-1): Q10.1(G) R11.1 R12.2
Net-(Q11-1): Q11.1(G) R13.1 R14.2
Net-(Q12-1): Q12.1(G) R15.1 R16.2
Net-(Q13-1): Q13.1(G) R17.1 R18.2
Net-(Q14-1): Q14.1(G) R19.1 R20.2
Net-(Q15-1): Q15.1(G) R31.1 R32.2
Net-(Q16-1): Q16.1(G) R33.1 R34.2
Net-(Q17-1): Q17.1(G) R28.1 R29.1
Net-(Q18-1): Q18.1(G) R87.1 R90.1
Net-(Q19-1): Q19.1(G) R91.1 R93.1
Net-(Q20-1): Q20.1(G) R103.1 R105.1
Net-(R9-1): R9.1 U12.2(A)
Net-(R12-1): R12.1 U17.2(A)
Net-(R14-1): R14.1 U18.2(A)
Net-(R16-1): R16.1 U19.2(A)
Net-(R18-1): R18.1 U20.2(A)
Net-(R20-1): R20.1 U21.2(A)
Net-(R32-1): R32.1 U22.2(A)
Net-(R34-1): R34.1 U23.2(A)
Net-(R69-2): R69.2 U7.2(A1)
Net-(R70-2): R70.2 U7.3(A2)
Net-(R71-2): R71.2 U26.2(A)
Net-(R72-2): R72.2 U7.4(A3)
Net-(R73-2): R73.2 U7.5(A4)
Net-(R76-1): R76.1 R79.2 U63.4(FB)
Net-(R77-2): R77.2 U32.3
Net-(R78-2): R78.2 U32.2
Net-(R80-2): R80.2 R81.1 U39.4(FB)
Net-(R82-2): R82.2 U42.9(A8)
Net-(R83-2): R83.2 U42.8(A7)
Net-(R84-2): R84.2 U42.7(A6)
Net-(R85-2): R85.2 U16.2(A)
Net-(R86-2): R86.2 U7.6(A5)
Net-(R92-2): R92.2 U4.9(A8)
Net-(R94-2): R94.2 U4.8(A7)
Net-(R95-2): R95.2 U4.7(A6)
Net-(R96-2): R96.2 U4.6(A5)
Net-(R97-2): R97.2 U4.5(A4)
Net-(R98-2): R98.2 U4.4(A3)
Net-(R99-2): R99.2 U4.3(A2)
Net-(R100-2): R100.2 U4.2(A1)
Net-(R113-2): R113.2 U14.2(A)
Net-(R114-2): R114.2 U7.7(A6)
Net-(R115-2): R115.2 U7.8(A7)
Net-(R116-2): R116.2 U7.9(A8)
Net-(R117-1): R117.1 U50.1(K)
Net-(R118-1): R118.1 USB1.2(D-)
Net-(R119-1): R119.1 USB1.3(D+)
Net-(R121-1): R121.1 U52.8(RS)
Net-(R123-1): R123.1 U9.2(A)
Net-(R124-2): R124.2 U42.18(Y1)
Net-(R125-2): R125.2 U42.17(Y2)
Net-(R126-2): R126.2 U42.16(Y3)
Net-(R127-2): R127.2 U42.15(Y4)
Net-(R128-2): R128.2 U42.14(Y5)
Net-(R129-2): R129.2 U42.6(A5)
Net-(R132-2): R132.2 U56.9(ISENB)
Net-(R133-2): R133.2 U56.6(ISENA)
Net-(R142-2): R142.2 U42.13(Y6)
Net-(R143-2): R143.2 U42.12(Y7)
Net-(R144-2): R144.2 U42.11(Y8)
Net-(R145-1): R145.1 U10.2(A)
Net-(R146-1): R146.1 U11.2(A)
Net-(R147-1): R147.1 U24.2(A)
Net-(R148-2): R148.2 U37.3(VOUT)
Net-(R156-1): R156.1 U25.2(A)
Net-(R158-1): R158.1 U27.2(A)
Net-(R159-1): R159.1 U28.2(A)
Net-(R160-1): R160.1 U29.2(A)
Net-(R176-2): R176.2 U42.5(A4)
Net-(R177-2): R177.2 U42.4(A3)
Net-(R178-2): R178.2 U42.3(A2)
Net-(R179-2): R179.2 U42.2(A1)
Net-(SW1-1): SW1.1 U41.1(C)
Net-(U34-1): U34.1 U35.2
Net-(U38-1): U38.1 U39.2(OUT) U40.1(C)
Net-(U56-12): U56.12(AVREF) U56.13(BVREF) U57.2
Net-(U62-1): U62.1(C) U63.2(OUT) U64.1

Not connected (* = marked no-connect by the designer): CN4 2; D19 3(IN)* 4(IN)* 13(IN)*; IC1 9(XO)* 10(XI)* 11(D-)* 12(D+)* 15(TXD)*; MICROSD1 1(DAT2)* 8(DAT1)* 9(CardDetect)*; U37 4(GND/UP2)* 5(GND/UP1)* 6(NC)* 7(NC)* 8(GND/CLK)*; U52 5(VREF)*; U53 18(PC3) 31(PA6) 32(PA7) 33(PC4) 34(PC5) 36(PB1) 43(PE12) 45(PE14) 46(PE15) 59(PD12) 64(PC7) 89(PB3) 90(PB4) 91(PB5); U56 18(nFAULT)* 19(DECAY)* 23(NC)* 27(nHOME)*; X3 3*

## Notes on the sheet
- POWER
- Connectors
- SD-CART
- Reset
- USB
- MAIN IC
- AUX-CPU-A13
- VREFF
- OSC1
- AUX-CPU-A6
- AUX-CPU-A7
- AUX-CPU-A14
- AUX-CPU-A15
- CANBUS
- AUX-CPU-A9
- STLINK
- Native USB
- BLUTOOTH
- OSC2
- AUX-CPU-D41
- AUX-CPU-D32
- AUX-CPU-D37
- (TX3)
- AUX-CPU-D35
- (RX3)
- Other output
- Injector Driver
- Ignition Driver
- sensors
- Baro
- Stepper Idle
- Other Analog Input
- Tacho
- Batt
- SP720
